# EAGLE schematic customESC_Test_Board (EAGLE 9.6.2)

## Sheet 1 of 4
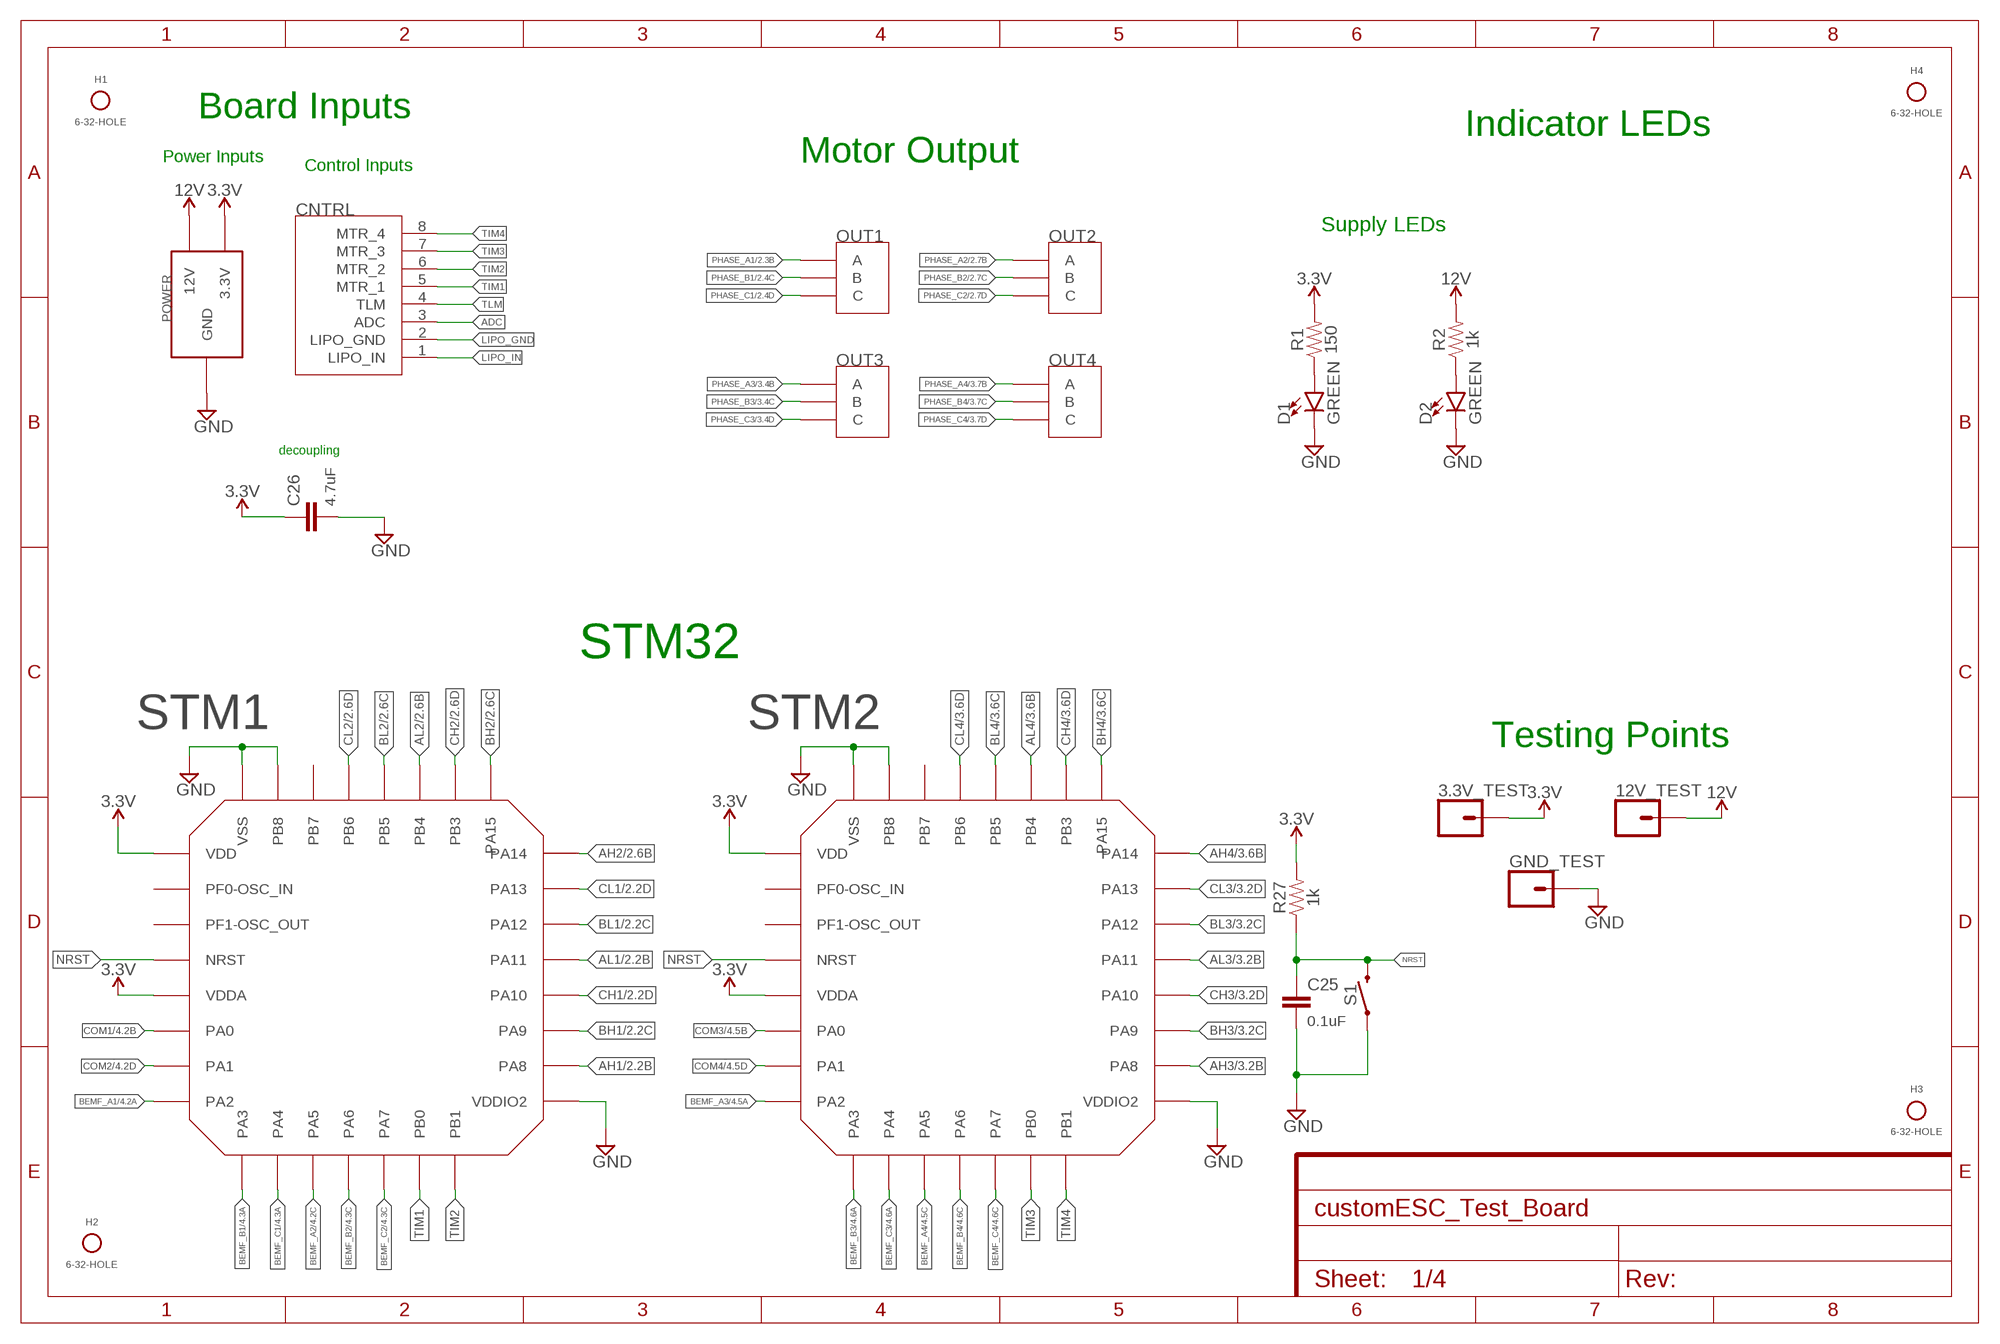
[diagram p0: schematic, sheet 1]

### Parts
3.3V_TEST  CONN_01  [1X01]
12V_TEST  CONN_01  [1X01]
C25  0.1uF  10UF-0603-6.3V-20%  [0603]
C26  4.7uF  10UF-0603-6.3V-20%  [0603]
CNTRL  JST_8_PIN  [JST_8_PIN]
D1  GREEN  LED-GREEN0603  [LED-0603]
D2  GREEN  LED-GREEN0603  [LED-0603]
GND_TEST  CONN_01  [1X01]
H1  6-32-HOLE  [MOUNTING_HOLE]
H2  6-32-HOLE  [MOUNTING_HOLE]
H3  6-32-HOLE  [MOUNTING_HOLE]
H4  6-32-HOLE  [MOUNTING_HOLE]
OUT1  IPBT-103-H1-T-S  [IPBT-103-H1-T-S]
OUT2  IPBT-103-H1-T-S  [IPBT-103-H1-T-S]
OUT3  IPBT-103-H1-T-S  [IPBT-103-H1-T-S]
OUT4  IPBT-103-H1-T-S  [IPBT-103-H1-T-S]
POWER  12V-CONNECTOR  [12V-CONNECTOR]
R1  150  1KOHM-0603-1/10W-1%  [0603]
R2  1k  1KOHM-0603-1/10W-1%  [0603]
R27  1k  1KOHM-0603-1/10W-1%  [0603]
S1  MOMENTARY-SWITCH-SPST-SMD-6.0X3.5MM  [TACTILE_SWITCH_SMD_6.0X3.5MM]
STM1  STM32F042K6T6  [STM32F042K6T6]
STM2  STM32F042K6T6  [STM32F042K6T6]

### Nets
ADC: CNTRL.3(ADC)
AH1: STM1.PA8 ; also sheet 2
AH2: STM1.PA14 ; also sheet 2
AH3: STM2.PA8 ; also sheet 3
AH4: STM2.PA14 ; also sheet 3
AL1: STM1.PA11 ; also sheet 2
AL2: STM1.PB4 ; also sheet 2
AL3: STM2.PA11 ; also sheet 3
AL4: STM2.PB4 ; also sheet 3
BEMF_A1: STM1.PA2 ; also sheet 4
BEMF_A2: STM1.PA5 ; also sheet 4
BEMF_A3: STM2.PA2 ; also sheet 4
BEMF_A4: STM2.PA5 ; also sheet 4
BEMF_B1: STM1.PA3 ; also sheet 4
BEMF_B2: STM1.PA6 ; also sheet 4
BEMF_B3: STM2.PA3 ; also sheet 4
BEMF_B4: STM2.PA6 ; also sheet 4
BEMF_C1: STM1.PA4 ; also sheet 4
BEMF_C2: STM1.PA7 ; also sheet 4
BEMF_C3: STM2.PA4 ; also sheet 4
BEMF_C4: STM2.PA7 ; also sheet 4
BH1: STM1.PA9 ; also sheet 2
BH2: STM1.PA15 ; also sheet 2
BH3: STM2.PA9 ; also sheet 3
BH4: STM2.PA15 ; also sheet 3
BL1: STM1.PA12 ; also sheet 2
BL2: STM1.PB5 ; also sheet 2
BL3: STM2.PA12 ; also sheet 3
BL4: STM2.PB5 ; also sheet 3
CH1: STM1.PA10 ; also sheet 2
CH2: STM1.PB3 ; also sheet 2
CH3: STM2.PA10 ; also sheet 3
CH4: STM2.PB3 ; also sheet 3
CL1: STM1.PA13 ; also sheet 2
CL2: STM1.PB6 ; also sheet 2
CL3: STM2.PA13 ; also sheet 3
CL4: STM2.PB6 ; also sheet 3
COM1: STM1.PA0 ; also sheet 4
COM2: STM1.PA1 ; also sheet 4
COM3: STM2.PA0 ; also sheet 4
COM4: STM2.PA1 ; also sheet 4
GND: C25.2 C26.2 D1.C D2.C GND_TEST.1 POWER.GND POWER.GND@1(GND) POWER.GND@2(GND) POWER.GND@3(GND) POWER.GND@4(GND) POWER.GND@5(GND) POWER.GND@6(GND) POWER.GND@7(GND) POWER.GND@8(GND) POWER.GND@9(GND) POWER.GND@10(GND) POWER.GND@11(GND) POWER.GND@12(GND) S1.1 STM1.PB8-BOOT0(PB8) STM1.VDDIO2 STM1.VSS STM1.VSS1(VSS) STM2.PB8-BOOT0(PB8) STM2.VDDIO2 STM2.VSS STM2.VSS1(VSS) ; also sheet 2,3,4
LIPO_GND: CNTRL.2(LIPO_GND)
LIPO_IN: CNTRL.1(LIPO_IN)
N$1: D1.A R1.1
N$2: D2.A R2.1
NRST: C25.1 R27.1 S1.2 STM1.NRST STM2.NRST
PHASE_A1: OUT1.1(A) ; also sheet 2,4
PHASE_A2: OUT2.1(A) ; also sheet 2,4
PHASE_A3: OUT3.1(A) ; also sheet 3,4
PHASE_A4: OUT4.1(A) ; also sheet 3,4
PHASE_B1: OUT1.2(B) ; also sheet 2,4
PHASE_B2: OUT2.2(B) ; also sheet 2,4
PHASE_B3: OUT3.2(B) ; also sheet 3,4
PHASE_B4: OUT4.2(B) ; also sheet 3,4
PHASE_C1: OUT1.3(C) ; also sheet 2,4
PHASE_C2: OUT2.3(C) ; also sheet 2,4
PHASE_C3: OUT3.3(C) ; also sheet 3,4
PHASE_C4: OUT4.3(C) ; also sheet 3,4
TIM1: CNTRL.5(MTR_1) STM1.PB0
TIM2: CNTRL.6(MTR_2) STM1.PB1
TIM3: CNTRL.7(MTR_3) STM2.PB0
TIM4: CNTRL.8(MTR_4) STM2.PB1
TLM: CNTRL.4(TLM)
VCC_1: 3.3V_TEST.1 C26.1 POWER.3.3V R1.2 R27.2 STM1.VDD STM1.VDDA STM2.VDD STM2.VDDA ; supply symbol labelled 3.3V
VCC_2: 12V_TEST.1 POWER.12V@1(12V) POWER.12V@2(12V) POWER.12V@3(12V) POWER.12V@4(12V) POWER.12V@5(12V) POWER.12V@6(12V) POWER.12V@7(12V) POWER.12V@8(12V) POWER.12V@9(12V) POWER.12V@10(12V) POWER.12V@11(12V) POWER.12V@12(12V) R2.2 ; supply symbol labelled 12V ; also sheet 2,3
Unconnected: STM1.PB7 STM1.PF0-OSC_IN STM1.PF1-OSC_OUT STM2.PB7 STM2.PF0-OSC_IN STM2.PF1-OSC_OUT

### Notes on the sheet
- Board Inputs
- Indicator LEDs
- Power Inputs | Motor Output
- Control Inputs
- Supply LEDs
- decoupling
- STM32
- Testing Points

## Sheet 2 of 4
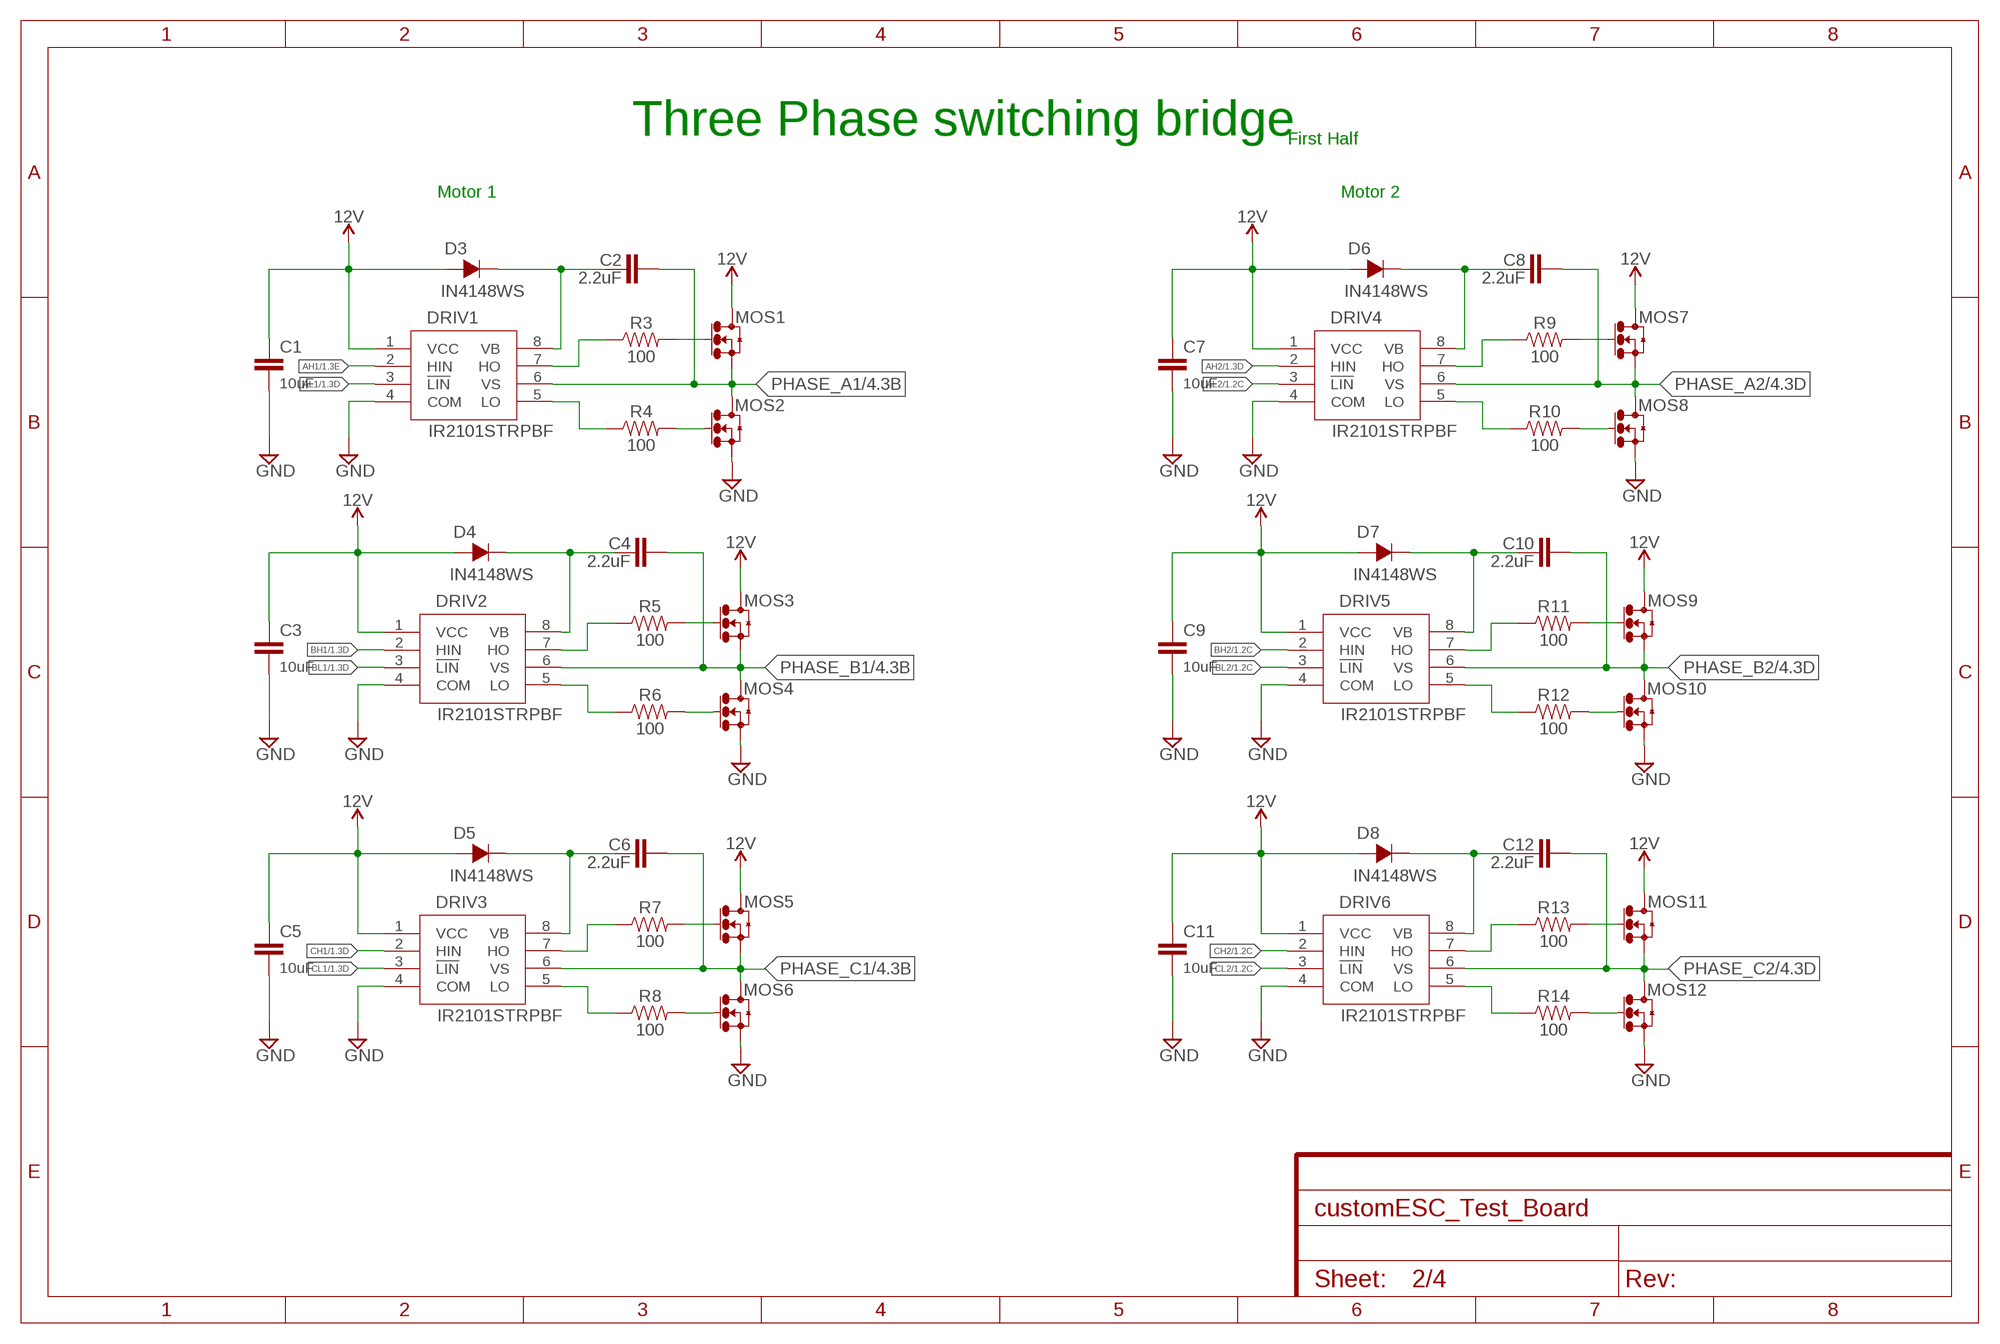
[diagram p1: schematic, sheet 2]

### Parts
C1  10uF  10UF-0603-6.3V-20%  [0603]
C2  2.2uF  10UF-0603-6.3V-20%  [0603]
C3  10uF  10UF-0603-6.3V-20%  [0603]
C4  2.2uF  10UF-0603-6.3V-20%  [0603]
C5  10uF  10UF-0603-6.3V-20%  [0603]
C6  2.2uF  10UF-0603-6.3V-20%  [0603]
C7  10uF  10UF-0603-6.3V-20%  [0603]
C8  2.2uF  10UF-0603-6.3V-20%  [0603]
C9  10uF  10UF-0603-6.3V-20%  [0603]
C10  2.2uF  10UF-0603-6.3V-20%  [0603]
C11  10uF  10UF-0603-6.3V-20%  [0603]
C12  2.2uF  10UF-0603-6.3V-20%  [0603]
D3  IN4148WS  [IN4148WS]
D4  IN4148WS  [IN4148WS]
D5  IN4148WS  [IN4148WS]
D6  IN4148WS  [IN4148WS]
D7  IN4148WS  [IN4148WS]
D8  IN4148WS  [IN4148WS]
DRIV1  IR2101STRPBF  [IR2101STRPBF]
DRIV2  IR2101STRPBF  [IR2101STRPBF]
DRIV3  IR2101STRPBF  [IR2101STRPBF]
DRIV4  IR2101STRPBF  [IR2101STRPBF]
DRIV5  IR2101STRPBF  [IR2101STRPBF]
DRIV6  IR2101STRPBF  [IR2101STRPBF]
MOS1  IRLR7843TRPBF  [IRLR7843TRPBF]
MOS2  IRLR7843TRPBF  [IRLR7843TRPBF]
MOS3  IRLR7843TRPBF  [IRLR7843TRPBF]
MOS4  IRLR7843TRPBF  [IRLR7843TRPBF]
MOS5  IRLR7843TRPBF  [IRLR7843TRPBF]
MOS6  IRLR7843TRPBF  [IRLR7843TRPBF]
MOS7  IRLR7843TRPBF  [IRLR7843TRPBF]
MOS8  IRLR7843TRPBF  [IRLR7843TRPBF]
MOS9  IRLR7843TRPBF  [IRLR7843TRPBF]
MOS10  IRLR7843TRPBF  [IRLR7843TRPBF]
MOS11  IRLR7843TRPBF  [IRLR7843TRPBF]
MOS12  IRLR7843TRPBF  [IRLR7843TRPBF]
R3  100  1KOHM-0603-1/10W-1%  [0603]
R4  100  1KOHM-0603-1/10W-1%  [0603]
R5  100  1KOHM-0603-1/10W-1%  [0603]
R6  100  1KOHM-0603-1/10W-1%  [0603]
R7  100  1KOHM-0603-1/10W-1%  [0603]
R8  100  1KOHM-0603-1/10W-1%  [0603]
R9  100  1KOHM-0603-1/10W-1%  [0603]
R10  100  1KOHM-0603-1/10W-1%  [0603]
R11  100  1KOHM-0603-1/10W-1%  [0603]
R12  100  1KOHM-0603-1/10W-1%  [0603]
R13  100  1KOHM-0603-1/10W-1%  [0603]
R14  100  1KOHM-0603-1/10W-1%  [0603]

### Nets
AH1: DRIV1.2(HIN) ; also sheet 1
AH2: DRIV4.2(HIN) ; also sheet 1
AL1: DRIV1.3(!LIN) ; also sheet 1
AL2: DRIV4.3(!LIN) ; also sheet 1
BH1: DRIV2.2(HIN) ; also sheet 1
BH2: DRIV5.2(HIN) ; also sheet 1
BL1: DRIV2.3(!LIN) ; also sheet 1
BL2: DRIV5.3(!LIN) ; also sheet 1
CH1: DRIV3.2(HIN) ; also sheet 1
CH2: DRIV6.2(HIN) ; also sheet 1
CL1: DRIV3.3(!LIN) ; also sheet 1
CL2: DRIV6.3(!LIN) ; also sheet 1
GND: C1.2 C3.2 C5.2 C7.2 C9.2 C11.2 DRIV1.4(COM) DRIV2.4(COM) DRIV3.4(COM) DRIV4.4(COM) DRIV5.4(COM) DRIV6.4(COM) MOS2.2(DRAIN) MOS2.4(DRAIN) MOS4.2(DRAIN) MOS4.4(DRAIN) MOS6.2(DRAIN) MOS6.4(DRAIN) MOS8.2(DRAIN) MOS8.4(DRAIN) MOS10.2(DRAIN) MOS10.4(DRAIN) MOS12.2(DRAIN) MOS12.4(DRAIN) ; also sheet 1,3,4
N$3: C2.1 D3.P$2 DRIV1.8(VB)
N$4: DRIV1.7(HO) R3.1
N$5: MOS1.1(GATE) R3.2
N$6: DRIV1.5(LO) R4.1
N$7: MOS2.1(GATE) R4.2
N$8: C4.1 D4.P$2 DRIV2.8(VB)
N$9: DRIV2.7(HO) R5.1
N$10: DRIV2.5(LO) R6.1
N$11: MOS3.1(GATE) R5.2
N$12: MOS4.1(GATE) R6.2
N$13: C6.1 D5.P$2 DRIV3.8(VB)
N$14: DRIV3.7(HO) R7.1
N$15: DRIV3.5(LO) R8.1
N$16: MOS5.1(GATE) R7.2
N$17: MOS6.1(GATE) R8.2
N$18: C8.1 D6.P$2 DRIV4.8(VB)
N$19: DRIV4.7(HO) R9.1
N$20: DRIV4.5(LO) R10.1
N$21: MOS7.1(GATE) R9.2
N$22: MOS8.1(GATE) R10.2
N$23: C10.1 D7.P$2 DRIV5.8(VB)
N$24: DRIV5.7(HO) R11.1
N$25: DRIV5.5(LO) R12.1
N$26: MOS9.1(GATE) R11.2
N$27: MOS10.1(GATE) R12.2
N$28: C12.1 D8.P$2 DRIV6.8(VB)
N$29: DRIV6.7(HO) R13.1
N$30: DRIV6.5(LO) R14.1
N$31: MOS11.1(GATE) R13.2
N$32: MOS12.1(GATE) R14.2
PHASE_A1: C2.2 DRIV1.6(VS) MOS1.2(DRAIN) MOS1.4(DRAIN) MOS2.3(SOURCE) ; also sheet 1,4
PHASE_A2: C8.2 DRIV4.6(VS) MOS7.2(DRAIN) MOS7.4(DRAIN) MOS8.3(SOURCE) ; also sheet 1,4
PHASE_B1: C4.2 DRIV2.6(VS) MOS3.2(DRAIN) MOS3.4(DRAIN) MOS4.3(SOURCE) ; also sheet 1,4
PHASE_B2: C10.2 DRIV5.6(VS) MOS9.2(DRAIN) MOS9.4(DRAIN) MOS10.3(SOURCE) ; also sheet 1,4
PHASE_C1: C6.2 DRIV3.6(VS) MOS5.2(DRAIN) MOS5.4(DRAIN) MOS6.3(SOURCE) ; also sheet 1,4
PHASE_C2: C12.2 DRIV6.6(VS) MOS11.2(DRAIN) MOS11.4(DRAIN) MOS12.3(SOURCE) ; also sheet 1,4
VCC_2: C1.1 C3.1 C5.1 C7.1 C9.1 C11.1 D3.P$1 D4.P$1 D5.P$1 D6.P$1 D7.P$1 D8.P$1 DRIV1.1(VCC) DRIV2.1(VCC) DRIV3.1(VCC) DRIV4.1(VCC) DRIV5.1(VCC) DRIV6.1(VCC) MOS1.3(SOURCE) MOS3.3(SOURCE) MOS5.3(SOURCE) MOS7.3(SOURCE) MOS9.3(SOURCE) MOS11.3(SOURCE) ; supply symbol labelled 12V ; also sheet 1,3

### Notes on the sheet
- Three Phase switching bridge
- First Half
- Motor 1 | Motor 2

## Sheet 3 of 4
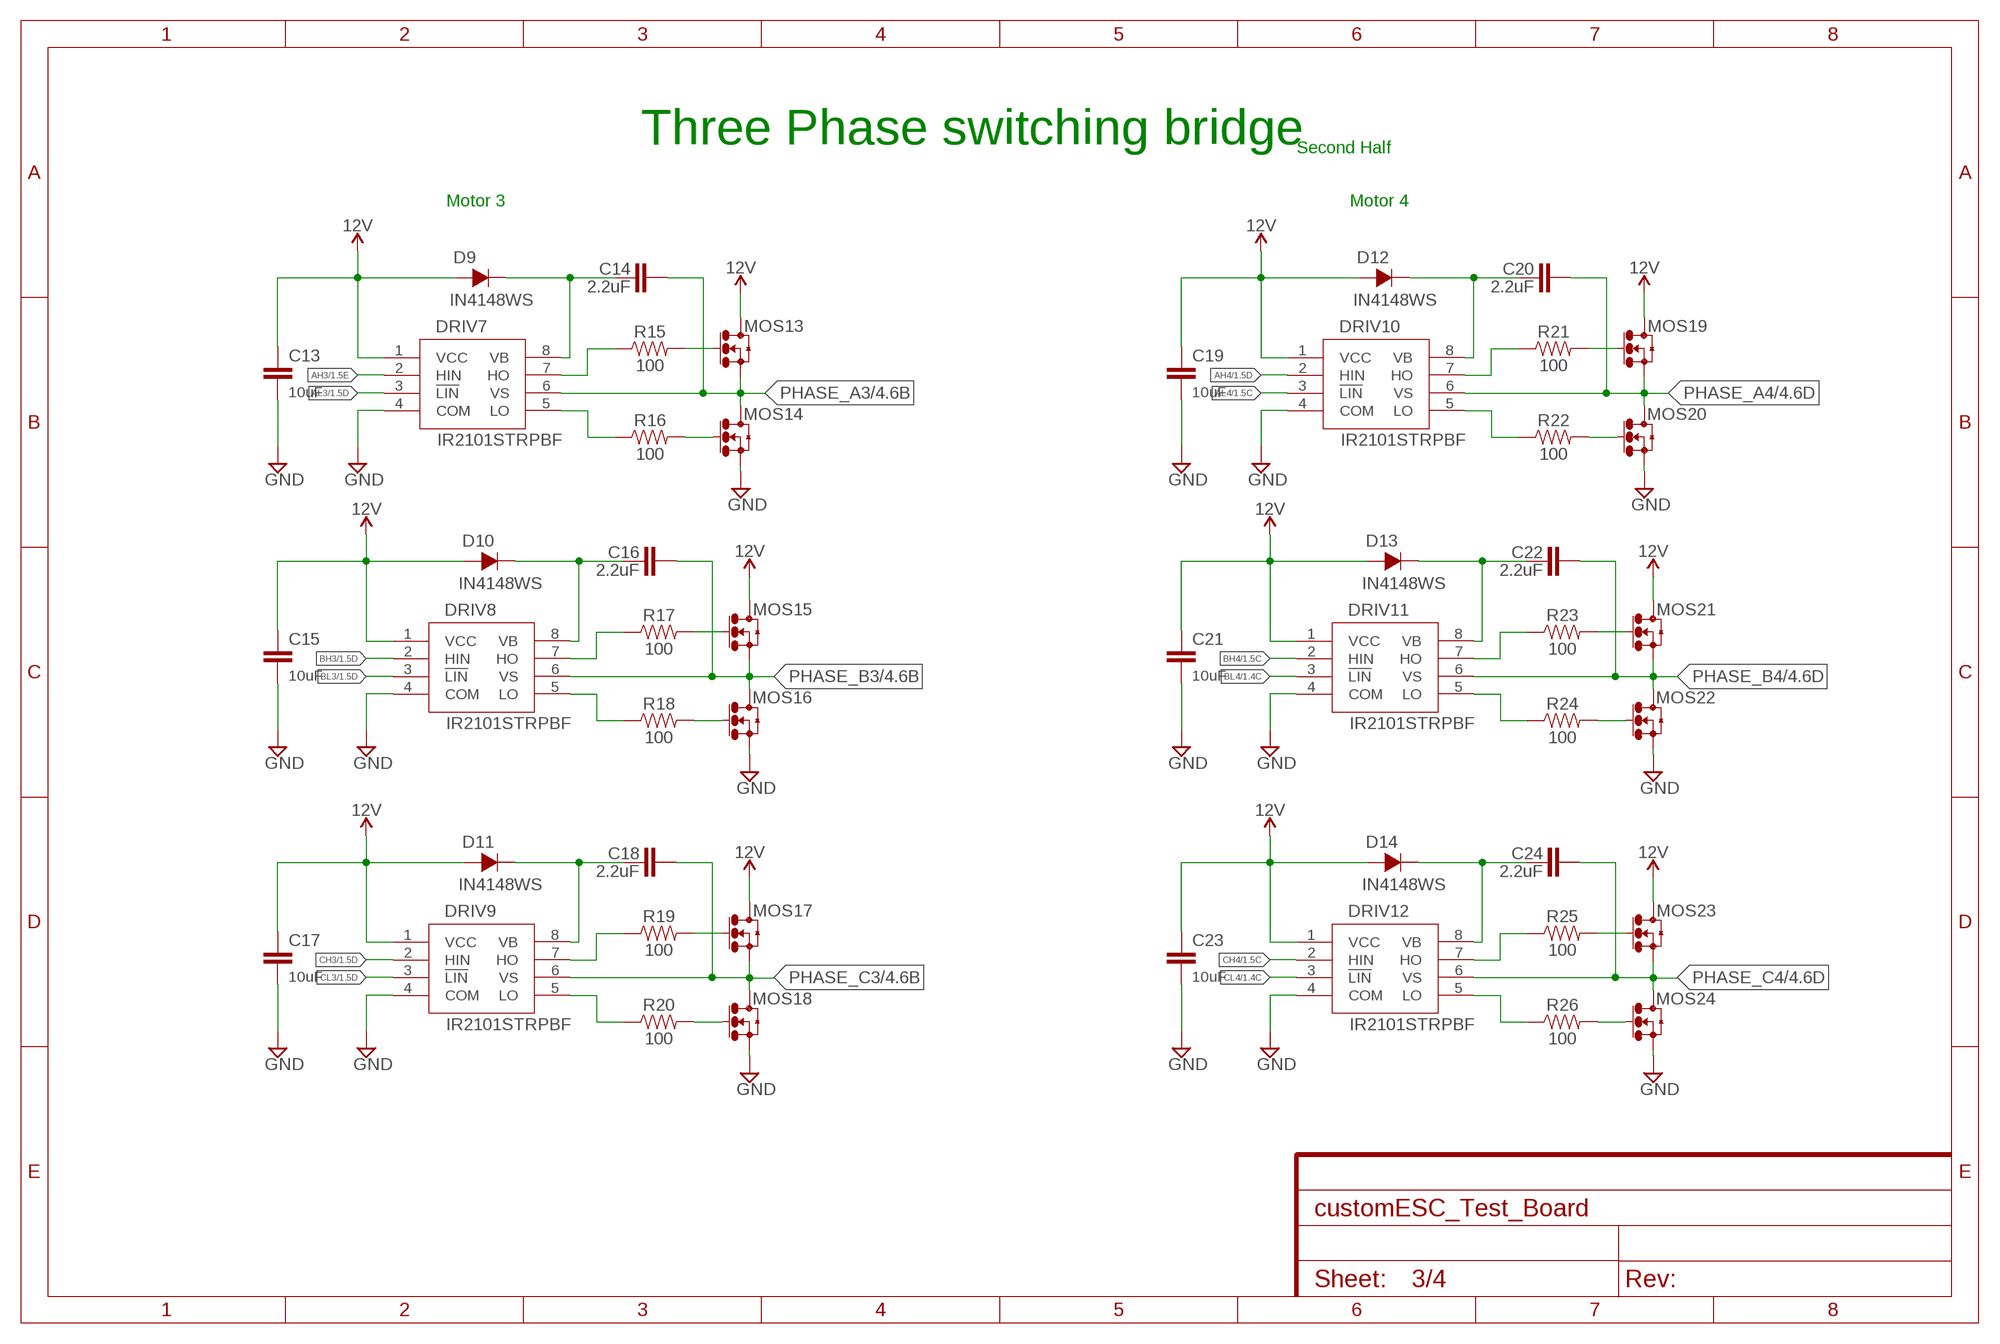
[diagram p2: schematic, sheet 3]

### Parts
C13  10uF  10UF-0603-6.3V-20%  [0603]
C14  2.2uF  10UF-0603-6.3V-20%  [0603]
C15  10uF  10UF-0603-6.3V-20%  [0603]
C16  2.2uF  10UF-0603-6.3V-20%  [0603]
C17  10uF  10UF-0603-6.3V-20%  [0603]
C18  2.2uF  10UF-0603-6.3V-20%  [0603]
C19  10uF  10UF-0603-6.3V-20%  [0603]
C20  2.2uF  10UF-0603-6.3V-20%  [0603]
C21  10uF  10UF-0603-6.3V-20%  [0603]
C22  2.2uF  10UF-0603-6.3V-20%  [0603]
C23  10uF  10UF-0603-6.3V-20%  [0603]
C24  2.2uF  10UF-0603-6.3V-20%  [0603]
D9  IN4148WS  [IN4148WS]
D10  IN4148WS  [IN4148WS]
D11  IN4148WS  [IN4148WS]
D12  IN4148WS  [IN4148WS]
D13  IN4148WS  [IN4148WS]
D14  IN4148WS  [IN4148WS]
DRIV7  IR2101STRPBF  [IR2101STRPBF]
DRIV8  IR2101STRPBF  [IR2101STRPBF]
DRIV9  IR2101STRPBF  [IR2101STRPBF]
DRIV10  IR2101STRPBF  [IR2101STRPBF]
DRIV11  IR2101STRPBF  [IR2101STRPBF]
DRIV12  IR2101STRPBF  [IR2101STRPBF]
MOS13  IRLR7843TRPBF  [IRLR7843TRPBF]
MOS14  IRLR7843TRPBF  [IRLR7843TRPBF]
MOS15  IRLR7843TRPBF  [IRLR7843TRPBF]
MOS16  IRLR7843TRPBF  [IRLR7843TRPBF]
MOS17  IRLR7843TRPBF  [IRLR7843TRPBF]
MOS18  IRLR7843TRPBF  [IRLR7843TRPBF]
MOS19  IRLR7843TRPBF  [IRLR7843TRPBF]
MOS20  IRLR7843TRPBF  [IRLR7843TRPBF]
MOS21  IRLR7843TRPBF  [IRLR7843TRPBF]
MOS22  IRLR7843TRPBF  [IRLR7843TRPBF]
MOS23  IRLR7843TRPBF  [IRLR7843TRPBF]
MOS24  IRLR7843TRPBF  [IRLR7843TRPBF]
R15  100  1KOHM-0603-1/10W-1%  [0603]
R16  100  1KOHM-0603-1/10W-1%  [0603]
R17  100  1KOHM-0603-1/10W-1%  [0603]
R18  100  1KOHM-0603-1/10W-1%  [0603]
R19  100  1KOHM-0603-1/10W-1%  [0603]
R20  100  1KOHM-0603-1/10W-1%  [0603]
R21  100  1KOHM-0603-1/10W-1%  [0603]
R22  100  1KOHM-0603-1/10W-1%  [0603]
R23  100  1KOHM-0603-1/10W-1%  [0603]
R24  100  1KOHM-0603-1/10W-1%  [0603]
R25  100  1KOHM-0603-1/10W-1%  [0603]
R26  100  1KOHM-0603-1/10W-1%  [0603]

### Nets
AH3: DRIV7.2(HIN) ; also sheet 1
AH4: DRIV10.2(HIN) ; also sheet 1
AL3: DRIV7.3(!LIN) ; also sheet 1
AL4: DRIV10.3(!LIN) ; also sheet 1
BH3: DRIV8.2(HIN) ; also sheet 1
BH4: DRIV11.2(HIN) ; also sheet 1
BL3: DRIV8.3(!LIN) ; also sheet 1
BL4: DRIV11.3(!LIN) ; also sheet 1
CH3: DRIV9.2(HIN) ; also sheet 1
CH4: DRIV12.2(HIN) ; also sheet 1
CL3: DRIV9.3(!LIN) ; also sheet 1
CL4: DRIV12.3(!LIN) ; also sheet 1
GND: C13.2 C15.2 C17.2 C19.2 C21.2 C23.2 DRIV7.4(COM) DRIV8.4(COM) DRIV9.4(COM) DRIV10.4(COM) DRIV11.4(COM) DRIV12.4(COM) MOS14.2(DRAIN) MOS14.4(DRAIN) MOS16.2(DRAIN) MOS16.4(DRAIN) MOS18.2(DRAIN) MOS18.4(DRAIN) MOS20.2(DRAIN) MOS20.4(DRAIN) MOS22.2(DRAIN) MOS22.4(DRAIN) MOS24.2(DRAIN) MOS24.4(DRAIN) ; also sheet 1,2,4
N$33: C14.1 D9.P$2 DRIV7.8(VB)
N$34: DRIV7.7(HO) R15.1
N$35: DRIV7.5(LO) R16.1
N$36: MOS13.1(GATE) R15.2
N$37: MOS14.1(GATE) R16.2
N$38: C16.1 D10.P$2 DRIV8.8(VB)
N$39: DRIV8.7(HO) R17.1
N$40: DRIV8.5(LO) R18.1
N$41: MOS15.1(GATE) R17.2
N$42: MOS16.1(GATE) R18.2
N$43: C18.1 D11.P$2 DRIV9.8(VB)
N$44: DRIV9.7(HO) R19.1
N$45: DRIV9.5(LO) R20.1
N$46: MOS17.1(GATE) R19.2
N$47: MOS18.1(GATE) R20.2
N$48: C20.1 D12.P$2 DRIV10.8(VB)
N$49: DRIV10.7(HO) R21.1
N$50: DRIV10.5(LO) R22.1
N$51: MOS19.1(GATE) R21.2
N$52: MOS20.1(GATE) R22.2
N$53: C22.1 D13.P$2 DRIV11.8(VB)
N$54: DRIV11.7(HO) R23.1
N$55: DRIV11.5(LO) R24.1
N$56: MOS21.1(GATE) R23.2
N$57: MOS22.1(GATE) R24.2
N$58: C24.1 D14.P$2 DRIV12.8(VB)
N$59: DRIV12.7(HO) R25.1
N$60: DRIV12.5(LO) R26.1
N$61: MOS23.1(GATE) R25.2
N$62: MOS24.1(GATE) R26.2
PHASE_A3: C14.2 DRIV7.6(VS) MOS13.2(DRAIN) MOS13.4(DRAIN) MOS14.3(SOURCE) ; also sheet 1,4
PHASE_A4: C20.2 DRIV10.6(VS) MOS19.2(DRAIN) MOS19.4(DRAIN) MOS20.3(SOURCE) ; also sheet 1,4
PHASE_B3: C16.2 DRIV8.6(VS) MOS15.2(DRAIN) MOS15.4(DRAIN) MOS16.3(SOURCE) ; also sheet 1,4
PHASE_B4: C22.2 DRIV11.6(VS) MOS21.2(DRAIN) MOS21.4(DRAIN) MOS22.3(SOURCE) ; also sheet 1,4
PHASE_C3: C18.2 DRIV9.6(VS) MOS17.2(DRAIN) MOS17.4(DRAIN) MOS18.3(SOURCE) ; also sheet 1,4
PHASE_C4: C24.2 DRIV12.6(VS) MOS23.2(DRAIN) MOS23.4(DRAIN) MOS24.3(SOURCE) ; also sheet 1,4
VCC_2: C13.1 C15.1 C17.1 C19.1 C21.1 C23.1 D9.P$1 D10.P$1 D11.P$1 D12.P$1 D13.P$1 D14.P$1 DRIV7.1(VCC) DRIV8.1(VCC) DRIV9.1(VCC) DRIV10.1(VCC) DRIV11.1(VCC) DRIV12.1(VCC) MOS13.3(SOURCE) MOS15.3(SOURCE) MOS17.3(SOURCE) MOS19.3(SOURCE) MOS21.3(SOURCE) MOS23.3(SOURCE) ; supply symbol labelled 12V ; also sheet 1,2

### Notes on the sheet
- Three Phase switching bridge
- Second Half
- Motor 3 | Motor 4

## Sheet 4 of 4
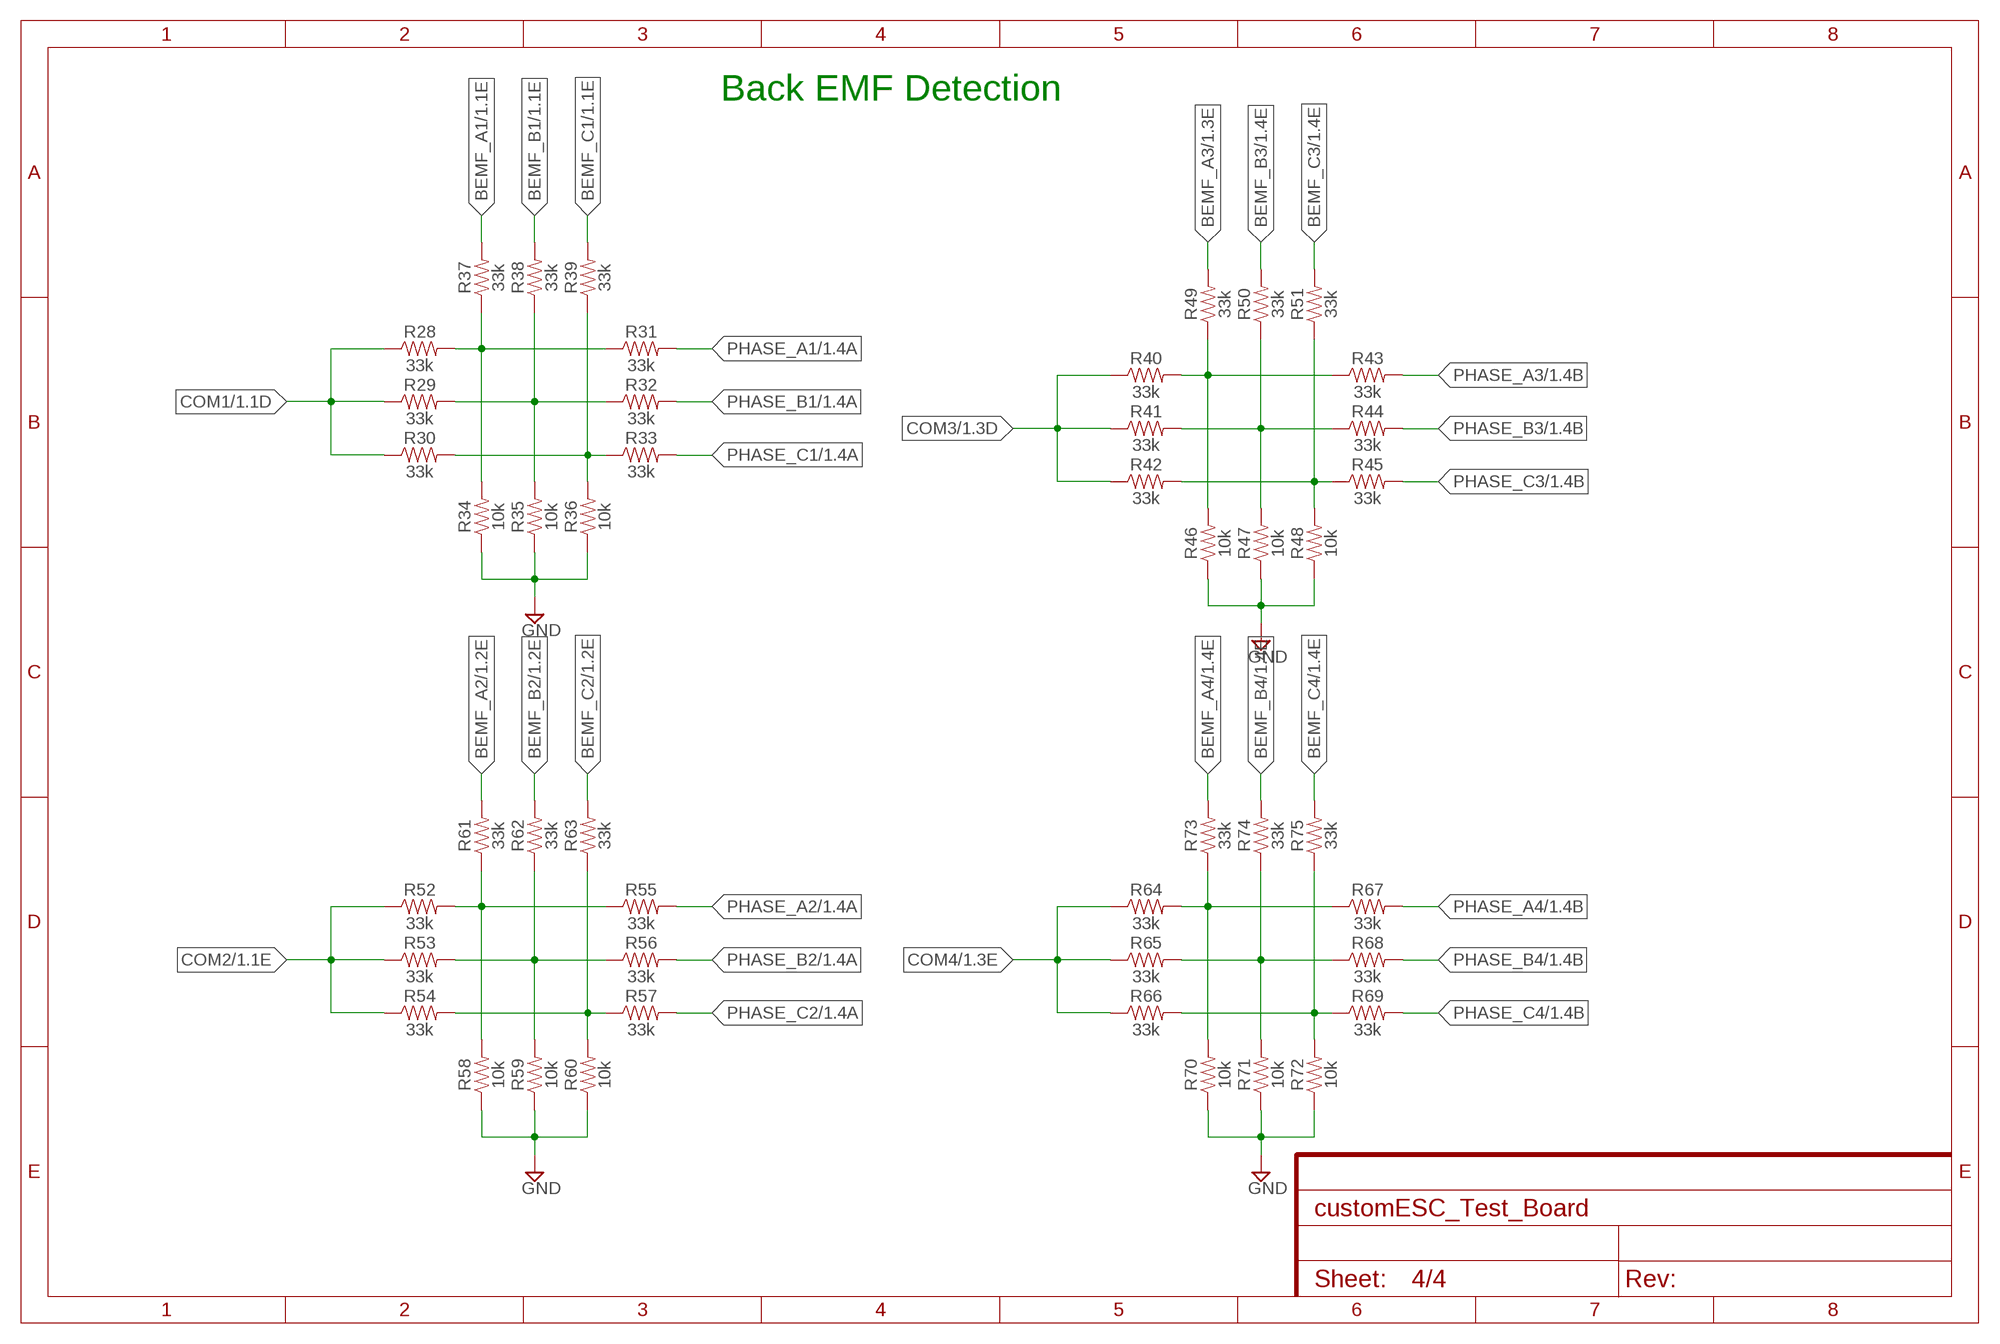
[diagram p3: schematic, sheet 4]

### Parts
R28  33k  1KOHM-0603-1/10W-1%  [0603]
R29  33k  1KOHM-0603-1/10W-1%  [0603]
R30  33k  1KOHM-0603-1/10W-1%  [0603]
R31  33k  1KOHM-0603-1/10W-1%  [0603]
R32  33k  1KOHM-0603-1/10W-1%  [0603]
R33  33k  1KOHM-0603-1/10W-1%  [0603]
R34  10k  1KOHM-0603-1/10W-1%  [0603]
R35  10k  1KOHM-0603-1/10W-1%  [0603]
R36  10k  1KOHM-0603-1/10W-1%  [0603]
R37  33k  1KOHM-0603-1/10W-1%  [0603]
R38  33k  1KOHM-0603-1/10W-1%  [0603]
R39  33k  1KOHM-0603-1/10W-1%  [0603]
R40  33k  1KOHM-0603-1/10W-1%  [0603]
R41  33k  1KOHM-0603-1/10W-1%  [0603]
R42  33k  1KOHM-0603-1/10W-1%  [0603]
R43  33k  1KOHM-0603-1/10W-1%  [0603]
R44  33k  1KOHM-0603-1/10W-1%  [0603]
R45  33k  1KOHM-0603-1/10W-1%  [0603]
R46  10k  1KOHM-0603-1/10W-1%  [0603]
R47  10k  1KOHM-0603-1/10W-1%  [0603]
R48  10k  1KOHM-0603-1/10W-1%  [0603]
R49  33k  1KOHM-0603-1/10W-1%  [0603]
R50  33k  1KOHM-0603-1/10W-1%  [0603]
R51  33k  1KOHM-0603-1/10W-1%  [0603]
R52  33k  1KOHM-0603-1/10W-1%  [0603]
R53  33k  1KOHM-0603-1/10W-1%  [0603]
R54  33k  1KOHM-0603-1/10W-1%  [0603]
R55  33k  1KOHM-0603-1/10W-1%  [0603]
R56  33k  1KOHM-0603-1/10W-1%  [0603]
R57  33k  1KOHM-0603-1/10W-1%  [0603]
R58  10k  1KOHM-0603-1/10W-1%  [0603]
R59  10k  1KOHM-0603-1/10W-1%  [0603]
R60  10k  1KOHM-0603-1/10W-1%  [0603]
R61  33k  1KOHM-0603-1/10W-1%  [0603]
R62  33k  1KOHM-0603-1/10W-1%  [0603]
R63  33k  1KOHM-0603-1/10W-1%  [0603]
R64  33k  1KOHM-0603-1/10W-1%  [0603]
R65  33k  1KOHM-0603-1/10W-1%  [0603]
R66  33k  1KOHM-0603-1/10W-1%  [0603]
R67  33k  1KOHM-0603-1/10W-1%  [0603]
R68  33k  1KOHM-0603-1/10W-1%  [0603]
R69  33k  1KOHM-0603-1/10W-1%  [0603]
R70  10k  1KOHM-0603-1/10W-1%  [0603]
R71  10k  1KOHM-0603-1/10W-1%  [0603]
R72  10k  1KOHM-0603-1/10W-1%  [0603]
R73  33k  1KOHM-0603-1/10W-1%  [0603]
R74  33k  1KOHM-0603-1/10W-1%  [0603]
R75  33k  1KOHM-0603-1/10W-1%  [0603]

### Nets
BEMF_A1: R37.2 ; also sheet 1
BEMF_A2: R61.2 ; also sheet 1
BEMF_A3: R49.2 ; also sheet 1
BEMF_A4: R73.2 ; also sheet 1
BEMF_B1: R38.2 ; also sheet 1
BEMF_B2: R62.2 ; also sheet 1
BEMF_B3: R50.2 ; also sheet 1
BEMF_B4: R74.2 ; also sheet 1
BEMF_C1: R39.2 ; also sheet 1
BEMF_C2: R63.2 ; also sheet 1
BEMF_C3: R51.2 ; also sheet 1
BEMF_C4: R75.2 ; also sheet 1
COM1: R28.1 R29.1 R30.1 ; also sheet 1
COM2: R52.1 R53.1 R54.1 ; also sheet 1
COM3: R40.1 R41.1 R42.1 ; also sheet 1
COM4: R64.1 R65.1 R66.1 ; also sheet 1
GND: R34.1 R35.1 R36.1 R46.1 R47.1 R48.1 R58.1 R59.1 R60.1 R70.1 R71.1 R72.1 ; also sheet 1,2,3
N$64: R28.2 R31.1 R34.2 R37.1
N$65: R29.2 R32.1 R35.2 R38.1
N$66: R30.2 R33.1 R36.2 R39.1
N$67: R40.2 R43.1 R46.2 R49.1
N$68: R41.2 R44.1 R47.2 R50.1
N$69: R42.2 R45.1 R48.2 R51.1
N$70: R52.2 R55.1 R58.2 R61.1
N$71: R53.2 R56.1 R59.2 R62.1
N$72: R54.2 R57.1 R60.2 R63.1
N$73: R64.2 R67.1 R70.2 R73.1
N$74: R65.2 R68.1 R71.2 R74.1
N$75: R66.2 R69.1 R72.2 R75.1
PHASE_A1: R31.2 ; also sheet 1,2
PHASE_A2: R55.2 ; also sheet 1,2
PHASE_A3: R43.2 ; also sheet 1,3
PHASE_A4: R67.2 ; also sheet 1,3
PHASE_B1: R32.2 ; also sheet 1,2
PHASE_B2: R56.2 ; also sheet 1,2
PHASE_B3: R44.2 ; also sheet 1,3
PHASE_B4: R68.2 ; also sheet 1,3
PHASE_C1: R33.2 ; also sheet 1,2
PHASE_C2: R57.2 ; also sheet 1,2
PHASE_C3: R45.2 ; also sheet 1,3
PHASE_C4: R69.2 ; also sheet 1,3

### Notes on the sheet
- Back EMF Detection

## Library data of the parts
3.3V_TEST 12V_TEST GND_TEST = SparkFun-Connectors:CONN_01: Single connection point. Often used as Generic Header-pin footprint for 0.1 inch spaced/style header connections On any of the 0.1 inch spaced packages, you can populate with these: Break Away Headers - Straight <https://www.sparkfun.com/products/116> (PRT-00116) Break Away Male Headers - Right Angle <https://www.sparkfun.com/products/553> (PRT-00553) Female Headers <https://www.sparkfun.com/products/115> (PRT-00115) Break Away Headers - Machine Pin <https://www.sparkfun.com/products/117> (PRT-00117) Break Away Female Headers - Swiss Machine Pin <https://www.sparkfun.com/products/743> (PRT-00743) This device is also useful as a general connection point to wire up your design to another part of your project. Our various solder wires solder well into these plated through hole pads. Hook-Up Wire - Assortment (Stranded, 22 AWG) <https://www.sparkfun.com/products/11375> (PRT-11375) Hook-Up Wire - Assortment (Solid Core, 22 AWG) <https://www.sparkfun.com/products/11367> (PRT-11367) View the entire wire category on our website here <https://www.sparkfun.com/categories/141> Special notes: SMTSO-256-ET is a "flush mount" nut for a 4-40 screw. We mostly use this on specialty testbeds; it is a nice way to connect hardware to your PCB at an adjustable hieght. Also note, the SNAP packages are for using a snappable style connector. We sell a baggie of snaps and they are also used on two LilyPad designs: Snap Assortment - 30 pack (male and female) <https://www.sparkfun.com/products/11347> (DEV-11347) LilyPad Arduino SimpleSnap <https://www.sparkfun.com/products/10941> (DEV-10941) LilyPad SimpleSnap Protoboard <https://www.sparkfun.com/products/10940> (DEV-10940)
C1 C3 C5 C7 C9 C11 C13 C15 C17 C19 C21 C23 = SparkFun-Capacitors:10UF: 10.0µF ceramic capacitors A capacitor is a passive two-terminal electrical component used to store electrical energy temporarily in an electric field.; PROD_ID: CAP-11015
C2 C4 C6 C8 C10 C12 C14 C16 C18 C20 C22 C24-C26 = SparkFun-Capacitors:10UF: 10.0µF ceramic capacitors A capacitor is a passive two-terminal electrical component used to store electrical energy temporarily in an electric field.; PROD_ID: CAP-11015; VALUE: 10uF
CNTRL = X15-CustomESC:JST_8_PIN: 8-pin JST connector JST connector to get signals from the ESC controller
D1 D2 = SparkFun-LED:LED-GREEN: Green SMD LED Used in manufacturing of various products at SparkFun Packages: 0603 - SMD 0603 package [Product Link] <http://www.futureelectronics.com/en/technologies/semiconductors/optoelectronics/leds/Pages/9894312-LTST-C190GKT.aspx?CrossPart=HSMG-C190&IM=0> LilyPad 1206 - SMD1206 LilyPad package [Product Link] <http://www.futureelectronics.com/en/Technologies/Product.aspx?ProductID=IN150NGHARVATEKCORPORATION2049943&IM=0> 1206 - SMD1206 package [Product Link] <http://www.futureelectronics.com/en/technologies/semiconductors/optoelectronics/leds/Pages/8315665-LTST-C150KGKT.aspx?IM=0> 1206 Bottom Mount -SMD 1206 Bottom Mount [Product Link] <http://www.digikey.com/product-detail/en/lite-on-inc/LTST-C230KGKT/160-1456-1-ND/386854> SparkFun Products: Pro Mini 328 -5V <https://www.sparkfun.com/products/821> RedBoard <https://www.sparkfun.com/products/12757> MP3 Trigger <https://www.sparkfun.com/products/13720> Makey Makey <https://www.sparkfun.com/products/11076>; PROD_ID: DIO-00821
D3-D14 = X15-CustomESC:IN4148WS
DRIV1-DRIV12 = X15-CustomESC:IR2101STRPBF: High and Low Side MOSFET Gate Driver Half-Bridge This is used in drving half-bridge in ESC circuit.
H1-H4 = X15-CustomESC:6-32-HOLE: 6-32 Mounting Hole Mounting hole for the scaffolding in the box
MOS1-MOS24 = X15-CustomESC:IRLR7843TRPBF: HEXFET power MOSFET N-CHANNEL 30V 3.3mOhm 161A
OUT1-OUT4 = X15-CustomESC:IPBT-103-H1-T-S
POWER = X15-CustomESC:12V-CONNECTOR: 12V backplane connector Connector to the backplane for 12V input
R1 R3-R26 R28-R75 = SparkFun-Resistors:1KOHM: 1kΩ resistor A resistor is a passive two-terminal electrical component that implements electrical resistance as a circuit element. Resistors act to reduce current flow, and, at the same time, act to lower voltage levels within circuits. - Wikipedia; PROD_ID: RES-07856; VALUE: 1k
R2 R27 = SparkFun-Resistors:1KOHM: 1kΩ resistor A resistor is a passive two-terminal electrical component that implements electrical resistance as a circuit element. Resistors act to reduce current flow, and, at the same time, act to lower voltage levels within circuits. - Wikipedia; PROD_ID: RES-07856
S1 = SparkFun-Switches:MOMENTARY-SWITCH-SPST: Momentary Switch (Pushbutton) - SPST Normally-open (NO) SPST momentary switches (buttons, pushbuttons). Variants PTH-12MM - 12mm square, through-hole Momentary Pushbutton Switch - 12mm Square <https://www.sparkfun.com/products/9190> (COM-09190) PTH-6.0MM, PTH-6.0MM-KIT - 6.0mm square, through-hole Mini Pushbutton Switch <https://www.sparkfun.com/products/97> (COM-00097) KIT package intended for soldering kit's - only one side of pads' copper is exposed. PTH-RIGHT-ANGLE-KIT - Right-angle, through-hole Right Angle Tactile Button <https://www.sparkfun.com/products/10791> - Used on SparkFun BigTime Watch Kit <https://www.sparkfun.com/products/11734> SMD-12MM - 12mm square, surface-mount Tactile Button - SMD (12mm) <https://www.sparkfun.com/products/12993> (COM-12993) Used on SparkFun PicoBoard <https://www.sparkfun.com/products/11888> SMD-4.5MM - 4.5mm Square Trackball Switch Used on SparkFun Blackberry Trackballer Breakout <https://www.sparkfun.com/products/13169> SMD-4.6MMX2.8MM - 4.60mm x 2.80mm, surface mount Used on SparkFun SAMD21 Mini Breakout <https://www.sparkfun.com/products/13664> SMD-5.2MM, SMD-5.2-REDUNDANT - 5.2mm square, surface-mount Mini Pushbutton Switch - SMD <https://www.sparkfun.com/products/8720> (COM-08720) Used on Arduino Pro Mini <https://www.sparkfun.com/products/11114> REDUNDANT package connects both switch circuits together SMD-6.0X3.5MM - 6.0 x 3.5mm, surface mount Momentary Reset Switch SMD <https://www.sparkfun.com/products/8229> (COM-08229) SMD-6.2MM-TALL - 6.2mm square, surface mount Tactile Button - SMD (6mm) <https://www.sparkfun.com/products/12992> Used on SparkFun Digital Sandbox <https://www.sparkfun.com/products/12651> SMD-RIGHT-ANGLE - Right-angle, surface mount Used on SparkFun Block for Intel® Edison - Arduino <https://www.sparkfun.com/products/13036>; PROD_ID: SWCH-00815; SF_SKU: COM-08229
STM1 STM2 = X15-CustomESC:STM32F042K6T6: STM32F042K6T6 chip ST Microcontroller chip